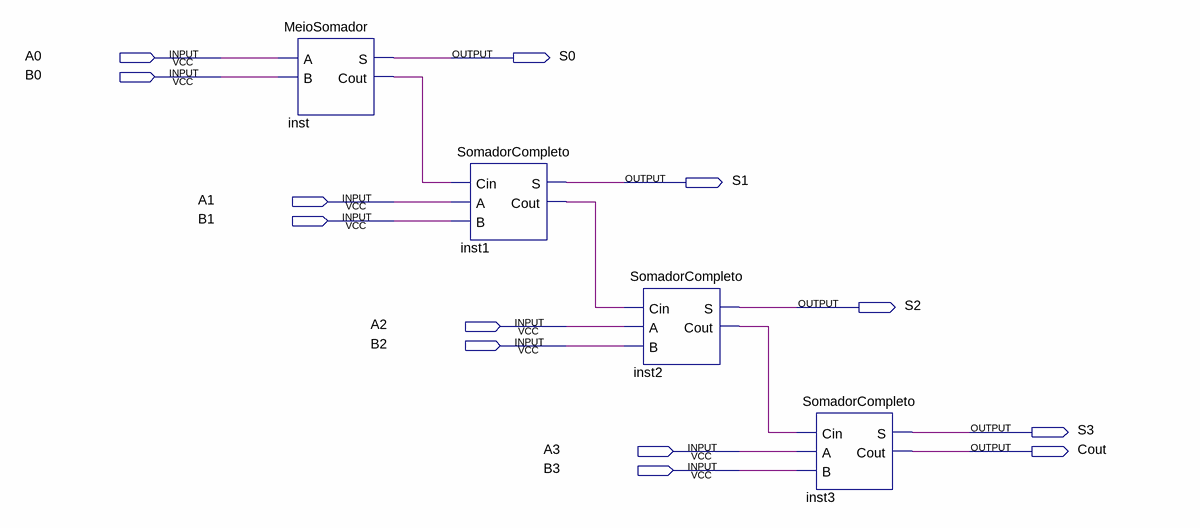
[diagram p0: schematic sheet]
// Quartus schematic SomadorDe4Bits.bdf as structural Verilog: 4 symbols, 13 pins
module SomadorDe4Bits (
  input  A0,
  input  B0,
  input  A1,
  input  B1,
  input  A2,
  input  B2,
  input  A3,
  input  B3,
  output S0,
  output S1,
  output S2,
  output S3,
  output Cout
);

  wire inst1_cout, inst2_cout, inst_cout;

  MeioSomador inst (.A(A0), .B(B0), .S(S0), .Cout(inst_cout));
  SomadorCompleto inst1 (.Cin(inst_cout), .A(A1), .B(B1), .S(S1), .Cout(inst1_cout));
  SomadorCompleto inst2 (.Cin(inst1_cout), .A(A2), .B(B2), .S(S2), .Cout(inst2_cout));
  SomadorCompleto inst3 (.Cin(inst2_cout), .A(A3), .B(B3), .S(S3), .Cout(Cout));
endmodule
